# Altium schematic sheet 02-USB3.SchDoc
size B; SheetNumber: 2; SheetTotal: 14
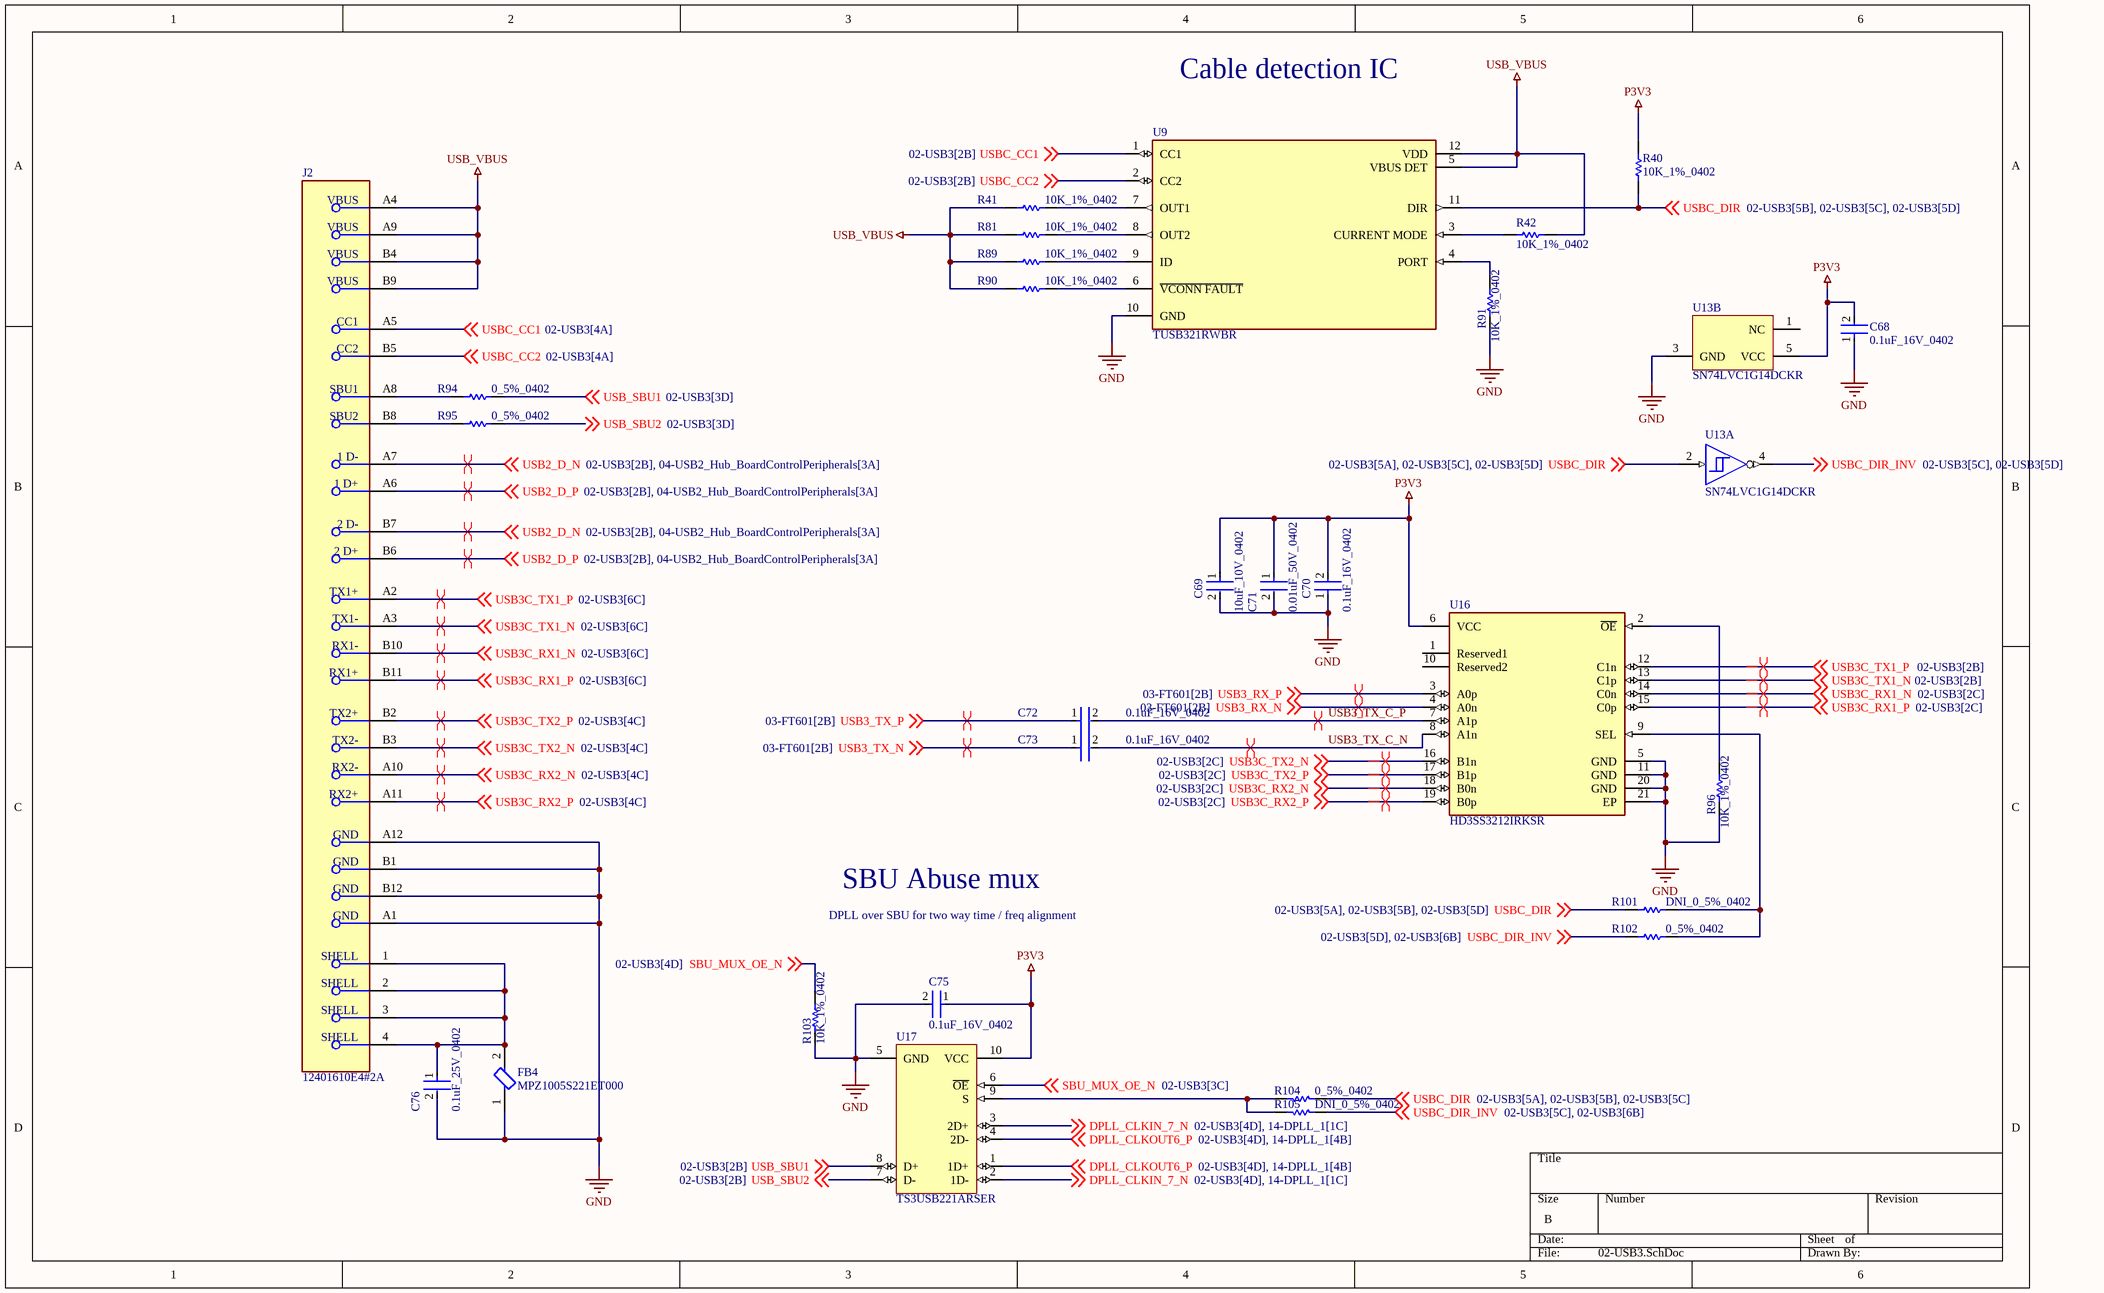
[diagram p0: 02-USB3.SchDoc]

## Parts
C68  0.1uF_16V_0402  [FP-C0402-BB-MFG]
C69  10uF_10V_0402  [FP-CL05A106MP5NUNC-MFG]
C70  0.1uF_16V_0402  [FP-C0402-BB-MFG]
C71  0.01uF_50V_0402  [FP-C0402-BB-MFG]
C72  0.1uF_16V_0402  [FP-C0402-BB-MFG]
C73  0.1uF_16V_0402  [FP-C0402-BB-MFG]
C75  0.1uF_16V_0402  [FP-C0402-BB-MFG]
C76  0.1uF_25V_0402  [FP-CGA2B-IPC_B]
FB4  MPZ1005S221ET000  [FP-MPZ1005-IPC_A]
J2  12401610E4#2A  [FP-12401610E4#2A-MFG]
R40  10K_1%_0402  [RESC1005X40X25NL10T10]
R41  10K_1%_0402  [RESC1005X40X25NL10T10]
R42  10K_1%_0402  [RESC1005X40X25NL10T10]
R81  10K_1%_0402  [RESC1005X40X25NL10T10]
R89  10K_1%_0402  [RESC1005X40X25NL10T10]
R90  10K_1%_0402  [RESC1005X40X25NL10T10]
R91  10K_1%_0402  [RESC1005X40X25NL10T10]
R94  0_5%_0402  [RESC1005X40X25NL05T10]
R95  0_5%_0402  [RESC1005X40X25NL05T10]
R96  10K_1%_0402  [RESC1005X40X25NL10T10]
R101  DNI_0_5%_0402  [RESC1005X40X25NL05T10]  (no BOM)
R102  0_5%_0402  [RESC1005X40X25NL05T10]
R103  10K_1%_0402  [RESC1005X40X25NL10T10]
R104  0_5%_0402  [RESC1005X40X25NL05T10]
R105  DNI_0_5%_0402  [RESC1005X40X25NL05T10]  (no BOM)
U9  TUSB321RWBR  [FP-RWB0012A-MFG]
U13  SN74LVC1G14DCKR  [DCK0005A_L]  (parts A,B of 2)
U16  HD3SS3212IRKSR  [FP-RKS0020A-MFG]
U17  TS3USB221ARSER  [RSE0010A_V]

## Nets
GND: C68.1 C69.2 C70.1 C71.2 C75.2 C76.2 FB4.1 J2.A1(GND) J2.A12(GND) J2.B1(GND) J2.B12(GND) R91.1 R96.1 R103.2 U9.10(GND) U13.3(GND) U16.5(GND) U16.11(GND) U16.20(GND) U16.21(EP) U17.5(GND)
P3V3: C68.2 C69.1 C70.2 C71.1 C75.1 R40.1 U13.5(VCC) U16.6(VCC) U17.10(VCC)
USB_VBUS: J2.A4(VBUS) J2.A9(VBUS) J2.B4(VBUS) J2.B9(VBUS) R41.2 R42.1 R81.2 R89.2 R90.2 U9.5(VBUS_DET) U9.12(VDD)
DPLL_CLKIN_7_N: U17.2(1D-) U17.3(2D+) ; off-sheet DPLL_CLKIN_7_N
DPLL_CLKOUT6_P: U17.1(1D+) U17.4(2D-) ; off-sheet DPLL_CLKOUT6_P
SBU_MUX_OE_N: R103.1 U17.6(~{OE}) ; off-sheet SBU_MUX_OE_N
USB2_D_N: J2.A7(1_D-) J2.B7(2_D-) ; off-sheet USB2_D_N
USB2_D_P: J2.A6(1_D+) J2.B6(2_D+) ; off-sheet USB2_D_P
USB3_RX_N: U16.4(A0n) ; off-sheet USB3_RX_N
USB3_RX_P: U16.3(A0p) ; off-sheet USB3_RX_P
USB3_TX_C_N: C73.2 U16.8(A1n)
USB3_TX_C_P: C72.2 U16.7(A1p)
USB3_TX_N: C73.1 ; off-sheet USB3_TX_N
USB3_TX_P: C72.1 ; off-sheet USB3_TX_P
USB3C_RX1_N: J2.B10(RX1-) U16.14(C0n) ; off-sheet USB3C_RX1_N
USB3C_RX1_P: J2.B11(RX1+) U16.15(C0p) ; off-sheet USB3C_RX1_P
USB3C_RX2_N: J2.A10(RX2-) U16.18(B0n) ; off-sheet USB3C_RX2_N
USB3C_RX2_P: J2.A11(RX2+) U16.19(B0p) ; off-sheet USB3C_RX2_P
USB3C_TX1_N: J2.A3(TX1-) U16.13(C1p) ; off-sheet USB3C_TX1_N
USB3C_TX1_P: J2.A2(TX1+) U16.12(C1n) ; off-sheet USB3C_TX1_P
USB3C_TX2_N: J2.B3(TX2-) U16.16(B1n) ; off-sheet USB3C_TX2_N
USB3C_TX2_P: J2.B2(TX2+) U16.17(B1p) ; off-sheet USB3C_TX2_P
USB_SBU1: R94.2 U17.8(D+) ; off-sheet USB_SBU1
USB_SBU2: R95.2 U17.7(D-) ; off-sheet USB_SBU2
USBC_CC1: J2.A5(CC1) U9.1(CC1) ; off-sheet USBC_CC1
USBC_CC2: J2.B5(CC2) U9.2(CC2) ; off-sheet USBC_CC2
USBC_DIR: R40.2 R101.1 R104.1 U9.11(DIR) U13.2(A) ; off-sheet USBC_DIR
USBC_DIR_INV: R102.1 R105.1 U13.4(Y) ; off-sheet USBC_DIR_INV
NetC76_1: C76.1 FB4.2 J2.1(SHELL) J2.2(SHELL) J2.3(SHELL) J2.4(SHELL)
NetJ2_A8: J2.A8(SBU1) R94.1
NetJ2_B8: J2.B8(SBU2) R95.1
NetR41_1: R41.1 U9.7(OUT1)
NetR42_2: R42.2 U9.3(CURRENT_MODE)
NetR81_1: R81.1 U9.8(OUT2)
NetR89_1: R89.1 U9.9(ID)
NetR90_1: R90.1 U9.6(~{VCONN_FAULT})
NetR91_2: R91.2 U9.4(PORT)
NetR96_2: R96.2 U16.2(~{OE})
NetR101_2: R101.2 R102.2 U16.9(SEL)
NetR104_2: R104.2 R105.2 U17.9(S)

Not connected (* = marked no-connect by the designer): U13 1(NC); U16 1(Reserved1) 10(Reserved2)

## Layout directives
differential pair: USB2_D_N, USB2_D_P, USB3_RX_N, USB3_RX_P, USB3_TX_C_N, USB3_TX_C_P, USB3_TX_N, USB3_TX_P, USB3C_RX1_N, USB3C_RX1_P, USB3C_RX2_N, USB3C_RX2_P, USB3C_TX1_N, USB3C_TX1_P, USB3C_TX2_N, USB3C_TX2_P

## Notes on the sheet
- Cable detection IC
- SBU Abuse mux
- DPLL over SBU for two way time / freq alignment

## Library data of the parts
C68 C70 C72 C73 C75 = CMP-1034-02068-3: CAP CER 0.1UF 16V 5% X7R 0402; Manufacturer: Kemet; Manufacturer Part Number: C0402C104J4RACTU; Value: 0.10 μF; Temperature Coefficient: 15%; Tolerance: 0.05; Material: Ceramic; ComponentLink2URL: https://content.kemet.com/datasheets/KEM_C1002_X7R_SMD.pdf; Automotive: No; Device Class L2: Capacitors; Temperature: -55°C to +125°C; RoHS: TRUE; Voltage Rating: 16 V; ComponentLink2Description: Datasheet; Device Class L3: Ceramic Capacitors; Temperature Range Low: -55°C; Ipc Land Pattern Name: CAPC10050X50; Device Class L1: Passive Components; Temperature Range High: +125°C; Package: C0402-BB; Capacitance: 0.10 μF; Category: Cap; Mouser Description: CAP CER 0.1UF 16V X7R 0402; Height: 0.55mm; Digikey Description: CAP CER 0.1UF 16V 5% X7R 0402; Octopart: https://octopart.com/c0402c104j4ractu-kemet-12573893; Temperature Characteristic: X7R; Lead Free: Yes
C69 = CMP-13271-000002-1: CAP CER 10UF 10V X5R 0402; Manufacturer Part Number: CL05A106MP5NUNC; Manufacturer: Samsung; Temperature Coefficient: 15%; Tolerance: 20%; Material: Ceramic; Octopart: https://octopart.com/cl05a106mp5nunc-samsung-22457395; Voltage Rating: 10V; RoHS: TRUE; Value: 10uF; Height: 0.7mm; Digikey Description: CAP CER 10UF 10V X5R 0402; Automotive: No; Package: CL05A106MP5NUNC; Device Class L1: Passive Components; Capacitance: 10uF; Temperature Range High: +85°C; ComponentLink2Description: Datasheet; Device Class L2: Capacitors; Temperature Characteristic: X5R; Temperature: -55°C to +85°C; ComponentLink2URL: http://www.samsungsem.com/kr/support/product-search/mlcc/__icsFiles/afieldfile/2019/05/10/19-CL05A106MP5NUNC.pdf; Device Class L3: Ceramic Capacitors; Category: Cap; Temperature Range Low: -55°C; Ipc Land Pattern Name: CAPC10050X50; Lead Free: Yes
C71 = CMP-2008-02109-2: CAP CER 10000PF 50V X7R 0402; Manufacturer: Kemet; Manufacturer Part Number: C0402C103K5RACTU; Temperature Coefficient: 15%; Tolerance: 0.1; Value: 10,000 pF; Material: Ceramic; Device Class L3: Ceramic Capacitors; Digikey Description: CAP CER 10000PF 50V X7R 0402; Height: 0.55mm; Temperature Range Low: -55°C; Package: C0402-BB; ComponentLink2URL: https://content.kemet.com/datasheets/KEM_C1002_X7R_SMD.pdf; Lead Free: Yes; Mouser Description: Capacitor; Ceramic; Cap; .010uF; Tol 10%; SMT; Vol-Rtg 50V; X7R; Tape and Reel; Ipc Land Pattern Name: CAPC10050X50; Temperature Range High: +125°C; Device Class L1: Passive Components; Category: Cap; Octopart: https://octopart.com/c0402c103k5ractu-kemet-95985; Temperature Characteristic: X7R; Automotive: No; Device Class L2: Capacitors; ComponentLink2Description: Datasheet; Voltage Rating: 50 V; Capacitance: 10,000 pF; RoHS: TRUE; Temperature: -55°C to +125°C
C76 = CMP-2000-06086-2: Cap Ceramic 100nF 25V X7R 10% Pad SMD 0402 +125°C Automotive T/R; Lead Free: Lead Free; Termination: SMD/SMT; Voltage Rating: 25V; Voltage: 25V; Composition: Ceramic; Case/Package: 0402; Mount: Surface Mount; Voltage Rating (DC): 25V; Tolerance: 10%; Length: 1mm; Width: 0.02inch; REACH SVHC: No SVHC; Max Operating Temperature: 125°C; Case Code (Metric): 1005; Case Code (Imperial): 0402; Package Quantity: 1; Depth: 0.5mm; Min Operating Temperature: -55°C; Thickness: 0.022inch; Capacitance: 100nF; Height: 0.5mm; Dielectric: X7R; Packaging: Tape and Reel; Weight: 2.3E-05oz; Ratings: AEC-Q200
FB4 = CMP-08257-000226-1: Power line Ferrite Bead 220Ω @ 100MHz 0.9A DCR 0.22Ω SMD 0402; Max Current Rating: 900mA; Impedance: 220R; Number of Lines: 1; DC Resistance (DCR): 220mR; Tolerance: 25%; Mount: Surface Mount; Case Code (Metric): 1005; Height: 0.022inch; Min Operating Temperature: -55°C; Max Operating Temperature: 125°C; RoHS Compliant: Yes; Length: 0.039inch; Width: 0.02inch; Case Code (Imperial): 0402; Case/Package: 0402; Package Quantity: 10000; Max DC Current: 900mA; Core Material: Ferrite; Packaging: Tape and Reel
J2 = CMP-02355-000003-1: CONN RCP USB3.1 TYPEC 24P SMD RA; Connector Type: USB; Number of Contacts: 24; Gender: Receptacle; Packaging: Cut Tape; Mount: Surface Mount; Number of Pins: 24
R40-R42 R81 R89-R91 R96 R103 = CMP-2002-04694-1: Manufacturer: Bourns; Part Number: CR0402-FX-1002GLF
R94 R95 R101 R102 R104 R105 = CMP-2002-06457-1: Manufacturer: Panasonic; Part Number: ERJ-U020R00X
U9 = CMP-04877-000009-1: IC INTERFACE SPECIALIZED 12X2QFN; Number of Ports: 1; Max Supply Voltage: 5.5V; Min Supply Voltage: 4.5V; USB Standard: USB 3.1; Max Operating Temperature: 70°C; Mount: Surface Mount; Number of Pins: 12; Lead Free: Lead Free; Min Operating Temperature: 0°C; REACH SVHC: No SVHC; Packaging: Tape and Reel; RoHS Compliant: Yes; Contact Plating: Gold
U13 = CMP-0859-00440-4: Single Schmitt-Trigger Inverter, DCK0005A, LARGE T&R; Manufacturer: Texas Instruments; Output Drive (IOL/IOH)(Max)(mA): 32/-32; Schmitt Trigger: Yes; Logic: Inverting; Bits(#): 1; Rating: Catalog; tpd @ Nom Voltage(Max)(ns): 11,6.5,5.5,5; Voltage(Nom)(V): 1.8,2.5,3.3,5; Output Type: CMOS; VCC(Min)(V): 1.65; ICC @ Nom Voltage(Max)(mA): 0.01; Input Type: CMOS/TTL; F @ Nom Voltage(Max)(Mhz): 150; VCC(Max)(V): 5.5; Sub-Family: Inverting Buffer/Driver; 3-State Output: No; Technology Family: LVC; PackageReference: DCK0005A; Operating Temperature Range(C): -40 to 125,-40 to 85; Generic Part Number: SN74LVC1G14; DatasheetVersion: SCES218W
U16 = CMP-04877-000012-1: IC MUX 2:1 8 OHM 20VQFN; USB Standard: USB 3.1; Min Supply Voltage: 3V; Max Supply Voltage: 3.6V; Data Rate: 480Mbps; Number of Ports: 2; Bandwidth: 8GHz; REACH SVHC: No SVHC; Lead Free: Lead Free; Max Operating Temperature: 85°C; Packaging: Tape and Reel; Case/Package: VQFN; Number of Pins: 20; Min Operating Temperature: -40°C
U17 = CMP-0309-00017-2: ESD Protected,High-Speed USB 2.0 (480-Mbps) 1:2 Multiplexer / Demultiplexer Switch, 1:2 Mux / Demux, 6 ohm RON, 2.5 to 3.3V, -40 to 85 degC, 10-Pin UQFN (RSE), Green (RoHS & no Sb/Br); Manufacturer: Texas Instruments; tpd max(ns): 0.25; RON Mis-match(Max)(Ohms): 0.2; OFF Time(Max)(ns): 12; Architecture: "1","2 mux/demux"; IL OFF(Max)(nA): 2; SubFamily: USB Switch; ESD HBM(kV): +/-7; ron(max)(ohms): 6; ON Time(Max)(ns): 30; Bandwidth(MHz): 900; RON Flatness(Max)(Ohms): 1; Vcc range(V): 2.3 to 3.6; Mounting Technology: Surface Mount; ComponentLink2URL: http://www.ti.com/lit/ml/mpqf186c/mpqf186c.pdf; PackageDescription: 10-Leads Plastic Quad Flatpack No-Lead, 2 x 1.5 x 0.55 mm Body, 0.5 mm Pitch; ComponentLink1URL: http://www.ti.com/general/docs/lit/getliterature.tsp?genericPartNumber=TS3USB221A&fileType=pdf; PackageReference: RSE0010A; ComponentLink2Description: Package Specification; PartNumber: TS3USB221ARSER; Code_JEDEC: MO-288-UEFD; DatasheetVersion: SCDS277; ComponentLink1Description: Datasheet; Eco-Plan: Green (RoHS & no Sb/Br); Number of Channels: 2; PackageVersion: revD, Jan-2011; ICC(uA): 30